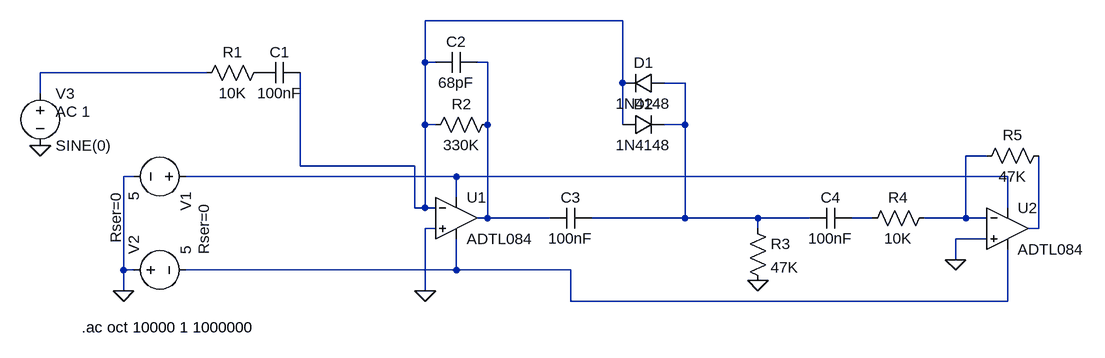
[diagram p0: schematic squale_modem_filter.asc]
squale_modem_filter.asc, the LTspice schematic file:
Version 4.1
SHEET 1 1228 680
WIRE 512 -128 208 -128
WIRE 208 -64 208 -128
WIRE 224 -64 208 -64
WIRE 304 -64 288 -64
WIRE -128 -48 -384 -48
WIRE 512 -32 512 -128
WIRE 608 -32 576 -32
WIRE -384 -16 -384 -48
WIRE 208 32 208 -64
WIRE 224 32 208 32
WIRE 304 32 304 -64
WIRE 512 32 512 -32
WIRE 608 32 608 -32
WIRE 608 32 576 32
WIRE 1072 80 1040 80
WIRE 16 96 16 -48
WIRE 192 96 16 96
WIRE -240 112 -256 112
WIRE 256 112 -160 112
WIRE 1104 112 256 112
WIRE 256 144 256 112
WIRE 192 160 192 96
WIRE 208 160 208 32
WIRE 208 160 192 160
WIRE 224 160 208 160
WIRE 1104 160 1104 112
WIRE 304 176 304 32
WIRE 304 176 288 176
WIRE 400 176 304 176
WIRE 608 176 608 32
WIRE 608 176 464 176
WIRE 720 176 608 176
WIRE 800 176 720 176
WIRE 896 176 864 176
WIRE 1040 176 1040 80
WIRE 1040 176 976 176
WIRE 1072 176 1040 176
WIRE 224 192 208 192
WIRE 720 192 720 176
WIRE 1152 192 1152 80
WIRE 1152 192 1136 192
WIRE 1072 208 1024 208
WIRE 1024 240 1024 208
WIRE -256 256 -256 112
WIRE -240 256 -256 256
WIRE 256 256 256 208
WIRE 256 256 -160 256
WIRE 432 256 256 256
WIRE -256 288 -256 256
WIRE 208 288 208 192
WIRE 432 304 432 256
WIRE 1104 304 1104 224
WIRE 1104 304 432 304
FLAG -256 288 0
FLAG 208 288 0
FLAG -384 64 0
FLAG 720 272 0
FLAG 1024 240 0
SYMBOL OpAmps\\ADTL084 256 112 R0
SYMATTR InstName U1
SYMBOL OpAmps\\ADTL084 1104 128 R0
SYMATTR InstName U2
SYMBOL voltage -144 112 R90
WINDOW 123 0 0 Left 0
WINDOW 39 24 124 Left 2
SYMATTR SpiceLine Rser=0
SYMATTR InstName V1
SYMATTR Value 5
SYMBOL voltage -256 256 R270
WINDOW 123 0 0 Left 0
WINDOW 39 24 124 Left 2
SYMATTR SpiceLine Rser=0
SYMATTR InstName V2
SYMATTR Value 5
SYMBOL res -32 -64 R90
WINDOW 0 0 56 VBottom 2
WINDOW 3 32 56 VTop 2
SYMATTR InstName R1
SYMATTR Value 10K
SYMBOL res 208 48 R270
WINDOW 0 32 56 VTop 2
WINDOW 3 0 56 VBottom 2
SYMATTR InstName R2
SYMATTR Value 330K
SYMBOL cap 16 -64 R90
WINDOW 0 0 32 VBottom 2
WINDOW 3 32 32 VTop 2
SYMATTR InstName C1
SYMATTR Value 100nF
SYMBOL cap 288 -80 R90
WINDOW 0 0 32 VBottom 2
WINDOW 3 32 32 VTop 2
SYMATTR InstName C2
SYMATTR Value 68pF
SYMBOL voltage -384 -32 R0
WINDOW 123 24 44 Left 2
WINDOW 39 0 0 Left 0
SYMATTR Value2 AC 1
SYMATTR InstName V3
SYMATTR Value SINE(0)
SYMBOL cap 464 160 R90
WINDOW 0 0 32 VBottom 2
WINDOW 3 32 32 VTop 2
SYMATTR InstName C3
SYMATTR Value 100nF
SYMBOL diode 576 -48 R90
WINDOW 0 0 32 VBottom 2
WINDOW 3 32 32 VTop 2
SYMATTR InstName D1
SYMATTR Value 1N4148
SYMBOL diode 512 48 R270
WINDOW 0 32 32 VTop 2
WINDOW 3 0 32 VBottom 2
SYMATTR InstName D2
SYMATTR Value 1N4148
SYMBOL res 704 176 R0
SYMATTR InstName R3
SYMATTR Value 47K
SYMBOL cap 864 160 R90
WINDOW 0 0 32 VBottom 2
WINDOW 3 32 32 VTop 2
SYMATTR InstName C4
SYMATTR Value 100nF
SYMBOL res 992 160 R90
WINDOW 0 0 56 VBottom 2
WINDOW 3 32 56 VTop 2
SYMATTR InstName R4
SYMATTR Value 10K
SYMBOL res 1168 64 R90
WINDOW 0 0 56 VBottom 2
WINDOW 3 32 56 VTop 2
SYMATTR InstName R5
SYMATTR Value 47K
TEXT -320 344 Left 2 !.ac oct 10000 1 1000000

The netlist it stands for:
* squale_modem_filter.asc
X§U1 0 N001 N006 N009 N002 ADTL084  ; pins In+ In- V+ V- OUT
X§U2 0 N005 N006 N009 N008 ADTL084  ; pins In+ In- V+ V- OUT
V1 N006 0 5 Rser=0
V2 0 N009 5 Rser=0
R1 P001 N003 10K
R2 N001 N002 330K
C1 N001 P001 100nF
C2 N002 N001 68pF
V3 N003 0 SINE(0) AC 1
C3 N004 N002 100nF
D1 N004 N001 1N4148
D2 N001 N004 1N4148
R3 N004 0 47K
C4 N007 N004 100nF
R4 N005 N007 10K
R5 N008 N005 47K
.model D D
.lib standard.dio
.ac oct 10000 1 1000000
.lib ADTL084.lib
.backanno
.end